# EAGLE design quadcopter_cape_v2 (EAGLE 6.5.0)
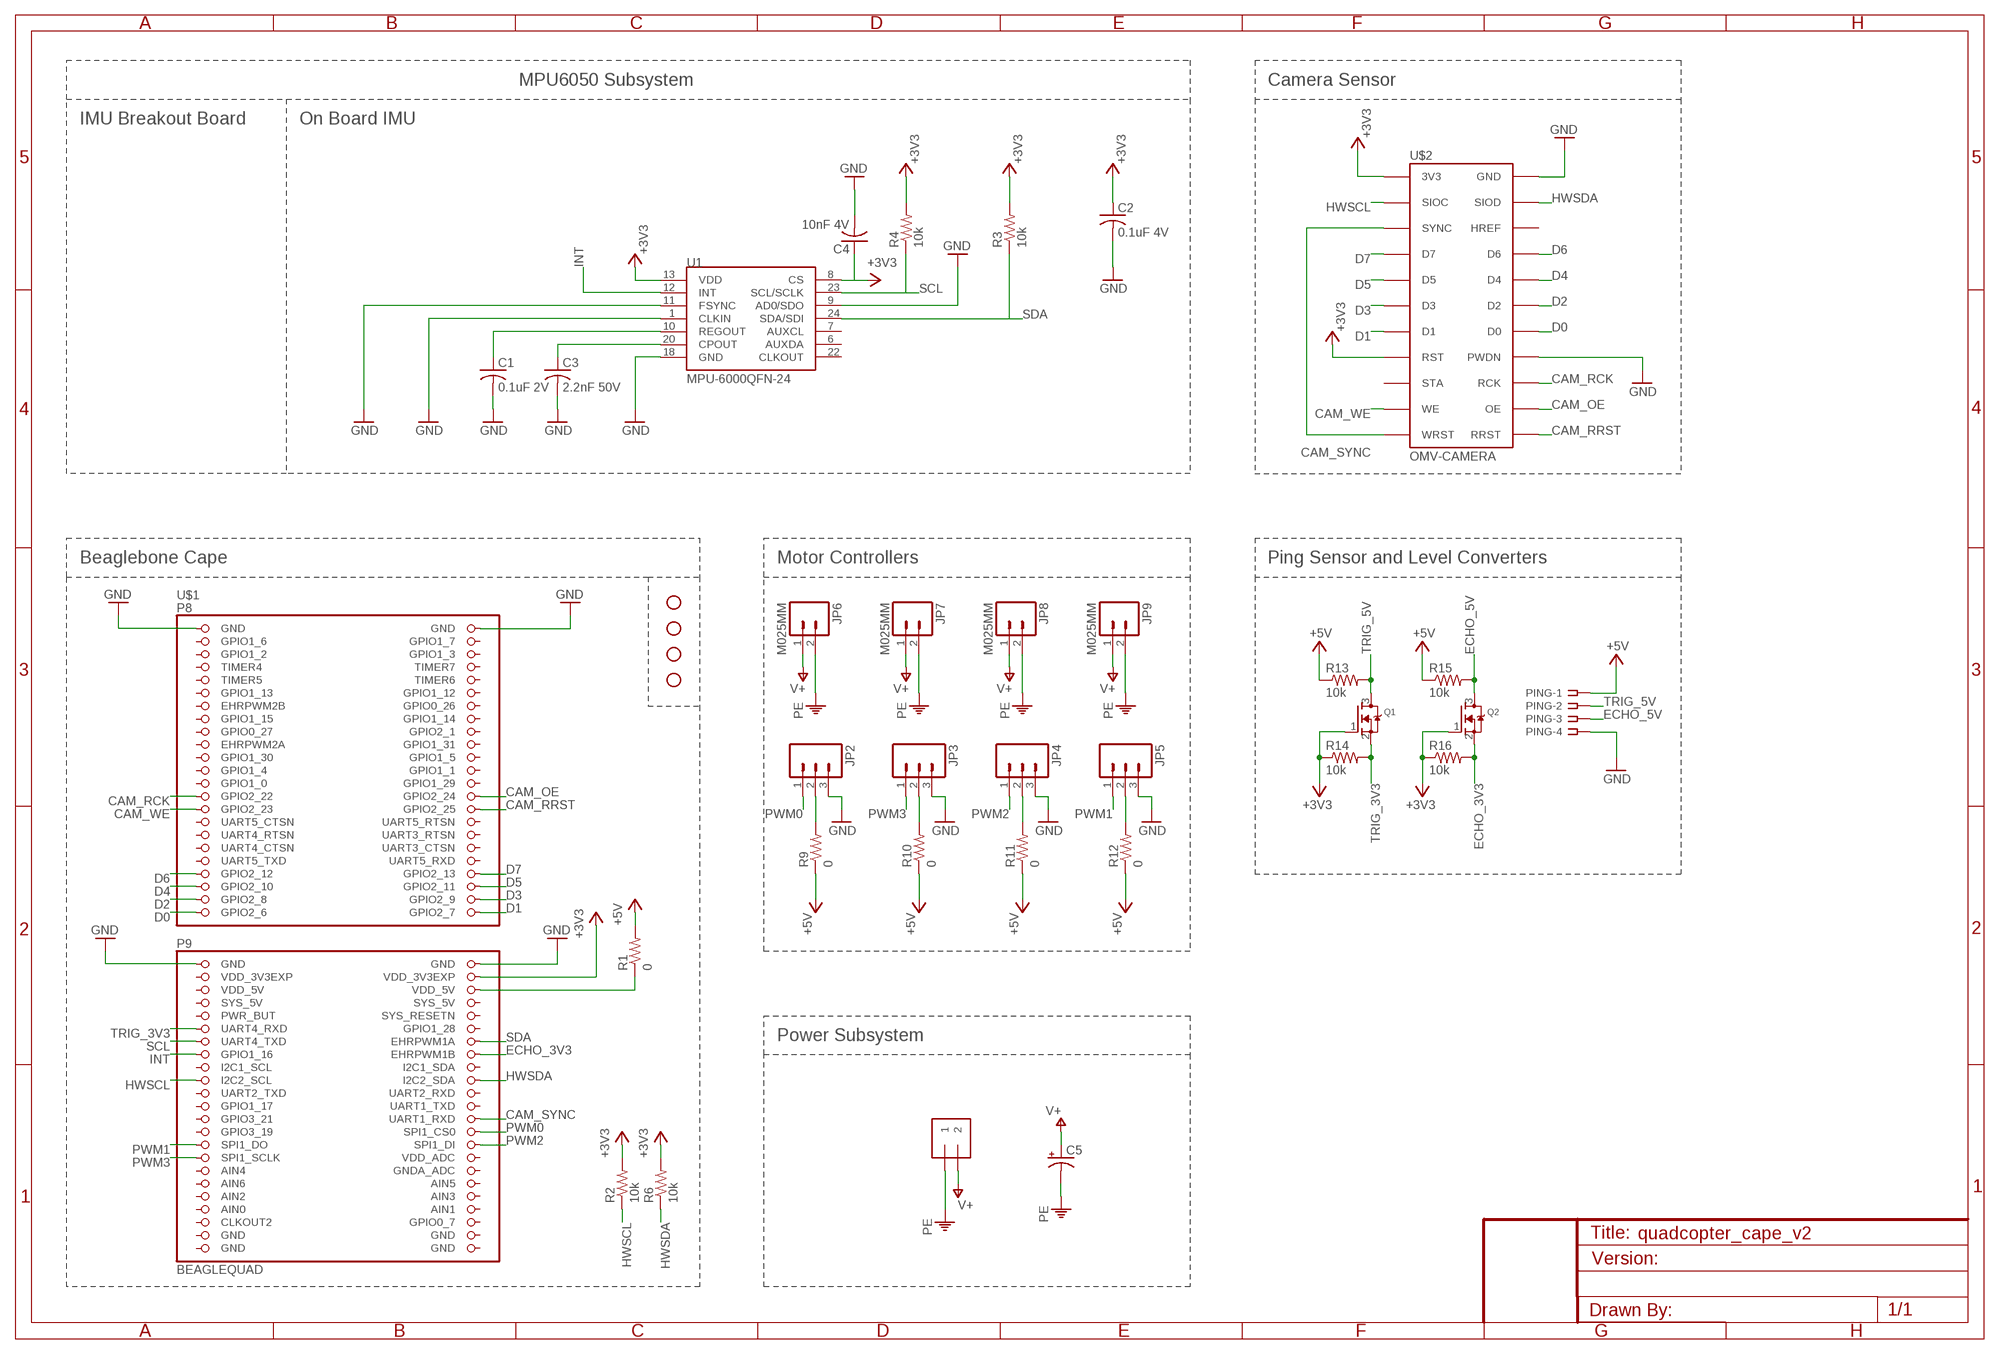
[diagram p0: schematic, sheet 1]

## Parts
C1  0.1uF 2V  C-USC0805  [C0805]
C2  0.1uF 4V  C-USC0805  [C0805]
C3  2.2nF 50V  C-USC0805  [C0805]
C4  10nF 4V  C-USC0805  [C0805]
C5  10UF-25V-20%(PTH)  [CPOL-RADIAL-10UF-25V]
JP2  M03PTH  [1X03]
JP3  M03PTH  [1X03]
JP4  M03PTH  [1X03]
JP5  M03PTH  [1X03]
JP6  M025MM  [SCREWTERMINAL-5MM-2]
JP7  M025MM  [SCREWTERMINAL-5MM-2]
JP8  M025MM  [SCREWTERMINAL-5MM-2]
JP9  M025MM  [SCREWTERMINAL-5MM-2]
PING  SSW-104-02-S-S-RA  [SSW-104-02-S-S-RA]
Q1  MOSFET-NREFLOW  [SOT23]
Q2  MOSFET-NREFLOW  [SOT23]
R1  0  R-US_M0805  [M0805]
R2  10k  R-US_M0805  [M0805]
R3  10k  R-US_M0805  [M0805]
R4  10k  R-US_M0805  [M0805]
R6  10k  R-US_M0805  [M0805]
R9  0  R-US_M0805  [M0805]
R10  0  R-US_M0805  [M0805]
R11  0  R-US_M0805  [M0805]
R12  0  R-US_M0805  [M0805]
R13  10k  R-US_M0805  [M0805]
R14  10k  R-US_M0805  [M0805]
R15  10k  R-US_M0805  [M0805]
R16  10k  R-US_M0805  [M0805]
STANDOFF1  STAND-OFF  [STAND-OFF]
STANDOFF2  STAND-OFF  [STAND-OFF]
STANDOFF3  STAND-OFF  [STAND-OFF]
STANDOFF4  STAND-OFF  [STAND-OFF]
U1  MPU-6000QFN-24  [QFN-24-TESTING]
U$1  BEAGLEQUAD  [BEAGLEQUAD_SHIELD]
U$2  OMV-CAMERA  [OMV-CAMERA]
U$3  1X2-12AWG  [1X2-12AWG]

## Nets
+3V3: C2.1 C4.1 Q1.1(G) Q2.1(G) R2.2 R3.2 R4.2 R6.2 R14.1 R16.1 U1.8(CS) U1.13(VDD) U$1.50(VDD_3V3EXP) U$2.3V3 U$2.RST
+5V: PING.1 R1.2 R9.1 R10.1 R11.1 R12.1 R13.1 R15.1
CAM_OE: U$1.28(GPIO2_24) U$2.OE
CAM_RCK: U$1.27(GPIO2_22) U$2.RCK
CAM_RRST: U$1.30(GPIO2_25) U$2.RRST
CAM_SYNC: U$1.72(UART1_RXD) U$2.SYNC U$2.WRST
CAM_WE: U$1.29(GPIO2_23) U$2.WE
D0: U$1.45(GPIO2_6) U$2.D0
D1: U$1.46(GPIO2_7) U$2.D1
D2: U$1.43(GPIO2_8) U$2.D2
D3: U$1.44(GPIO2_9) U$2.D3
D4: U$1.41(GPIO2_10) U$2.D4
D5: U$1.42(GPIO2_11) U$2.D5
D6: U$1.39(GPIO2_12) U$2.D6
D7: U$1.40(GPIO2_13) U$2.D7
ECHO_3V3: Q2.2(S) R16.2 U$1.62(EHRPWM1B)
ECHO_5V: PING.3 Q2.3(D) R15.2
GND: C1.2 C2.2 C3.2 C4.2 JP2.3 JP3.3 JP4.3 JP5.3 PING.4 U1.1(CLKIN) U1.9(AD0/SDO) U1.11(FSYNC) U1.18(GND) U$1.1(GND) U$1.2(GND) U$1.47(GND) U$1.48(GND) U$2.GND U$2.PWDN
HWSCL: R2.1 U$1.65(I2C2_SCL) U$2.SIOC
HWSDA: R6.1 U$1.66(I2C2_SDA) U$2.SIOD
INT: U1.12(INT) U$1.61(GPIO1_16)
N$1: R1.1 U$1.52(VDD_5V)
N$3: C1.1 U1.10(REGOUT)
N$4: C3.1 U1.20(CPOUT)
N$10: JP2.2 R9.2
N$11: JP3.2 R10.2
N$12: JP4.2 R11.2
N$13: JP5.2 R12.2
PE: C5.2(-) JP6.2 JP7.2 JP8.2 JP9.2 U$3.P$1
PWM0: JP2.1 U$1.74(SPI1_CS0)
PWM1: JP5.1 U$1.75(SPI1_DO)
PWM2: JP4.1 U$1.76(SPI1_DI)
PWM3: JP3.1 U$1.77(SPI1_SCLK)
SCL: R4.1 U1.23(SCL/SCLK) U$1.59(UART4_TXD)
SDA: R3.1 U1.24(SDA/SDI) U$1.60(EHRPWM1A)
TRIG_3V3: Q1.2(S) R14.2 U$1.57(UART4_RXD)
TRIG_5V: PING.2 Q1.3(D) R13.2
V+: C5.1(+) JP6.1 JP7.1 JP8.1 JP9.1 U$3.P$2
Unconnected: U1.6(AUXDA) U1.7(AUXCL) U1.22(CLKOUT) U$1.3(GPIO1_6) U$1.4(GPIO1_7) U$1.5(GPIO1_2) U$1.6(GPIO1_3) U$1.7(TIMER4) U$1.8(TIMER7) U$1.9(TIMER5) U$1.10(TIMER6) U$1.11(GPIO1_13) U$1.12(GPIO1_12) U$1.13(EHRPWM2B) U$1.14(GPIO0_26) U$1.15(GPIO1_15) U$1.16(GPIO1_14) U$1.17(GPIO0_27) U$1.18(GPIO2_1) U$1.19(EHRPWM2A) U$1.20(GPIO1_31) U$1.21(GPIO1_30) U$1.22(GPIO1_5) U$1.23(GPIO1_4) U$1.24(GPIO1_1) U$1.25(GPIO1_0) U$1.26(GPIO1_29) U$1.31(UART5_CTSN) U$1.32(UART5_RTSN) U$1.33(UART4_RTSN) U$1.34(UART3_RTSN) U$1.35(UART4_CTSN) U$1.36(UART3_CTSN) U$1.37(UART5_TXD) U$1.38(UART5_RXD) U$1.54(SYS_5V) U$1.55(PWR_BUT) U$1.56(SYS_RESETN) U$1.58(GPIO1_28) U$1.63(I2C1_SCL) U$1.64(I2C1_SDA) U$1.67(UART2_TXD) U$1.68(UART2_RXD) U$1.69(GPIO1_17) U$1.70(UART1_TXD) U$1.71(GPIO3_21) U$1.73(GPIO3_19) U$1.78(VDD_ADC) U$1.79(AIN4) U$1.80(GNDA_ADC) U$1.81(AIN6) U$1.82(AIN5) U$1.83(AIN2) U$1.84(AIN3) U$1.86(AIN1) U$1.87(CLKOUT2) U$1.88(GPIO0_7) U$2.HREF U$2.STA

## Notes on the sheet
- MPU6050 Subsystem | Camera Sensor
- IMU Breakout Board | On Board IMU
- Beaglebone Cape | Motor Controllers | Ping Sensor and Level Converters
- Power Subsystem

## Power pins joined to a net without a drawn wire
AIN0: U$1.85(AIN0)
GND: U$1.89(GND) U$1.90(GND) U$1.91(GND) U$1.92(GND)
SYS_5V: U$1.53(SYS_5V)
VDD_3V3EXP: U$1.49(VDD_3V3EXP)
VDD_5V: U$1.51(VDD_5V)

## Library data of the parts
C1-C4 = resistor:C-US: CAPACITOR, American symbol
C5 = SparkFun-Capacitors:10UF-25V-20%(PTH): CAP-08440; PROD_ID: CAP-08440
JP2-JP5 = SparkFun-Connectors:M03: Header 3 Standard 3-pin 0.1" header. Use with straight break away headers (SKU : PRT-00116), right angle break away headers (PRT-00553), swiss pins (PRT-00743), machine pins (PRT-00117), and female headers (PRT-00115). Molex polarized connector foot print use with SKU : PRT-08232 with associated crimp pins and housings.
JP6-JP9 = SparkFun-Connectors:M02: Standard 2-pin 0.1" header. Use with - straight break away headers ( PRT-00116) - right angle break away headers (PRT-00553) - swiss pins (PRT-00743) - machine pins (PRT-00117) - female headers (PRT-00115) Molex polarized connector foot print use with: PRT-08233 with associated crimp pins and housings. 2.54_SCREWTERM for use with PRT-10571. 3.5mm Screw Terminal footprints for PRT-08084 5mm Screw Terminal footprints for use with PRT-08433
PING = con-samtec:SSW-104-02-S-S: THROUGH-HOLE .025" SQ POST SOCKET Source: Samtec SSW.pdf; MPN: SSW-104-02-S-S-RA; OC_FARNELL: unknown; OC_NEWARK: 11P9385
Q1 Q2 = adafruit:MOSFET-N: N-Channel Mosfet 2N7002E - 60V 260mA SOT23 [Digikey: 2N7002ET1GOSTR-ND] - REEL BSH103 - 30V 850mA SOT23 [Digikey: 568-5013-1-ND]
R1-R4 R6 R9-R16 = resistor:R-US_: RESISTOR, American symbol
STANDOFF1-STANDOFF4 = SparkFun-Electromechanical:STAND-OFF: #4 Stand Off This is the mechanical footprint for a #4 phillips button head screw. Use the keepout ring to avoid running the screw head into surrounding components. SKU : PRT-00447
U1 = SparkFun-Sensors:MPU-6000: MPU-6000 - I2C address is 0x68 with AD0 low and 0x69 with AD0 high.
U$1 = adafruit:BEAGLEQUAD: Beaglebone Black Quadcopter Cape V2.0
U$2 = adafruit:OMV-CAMERA
U$3 = adafruit:1X2-12AWG

## Board
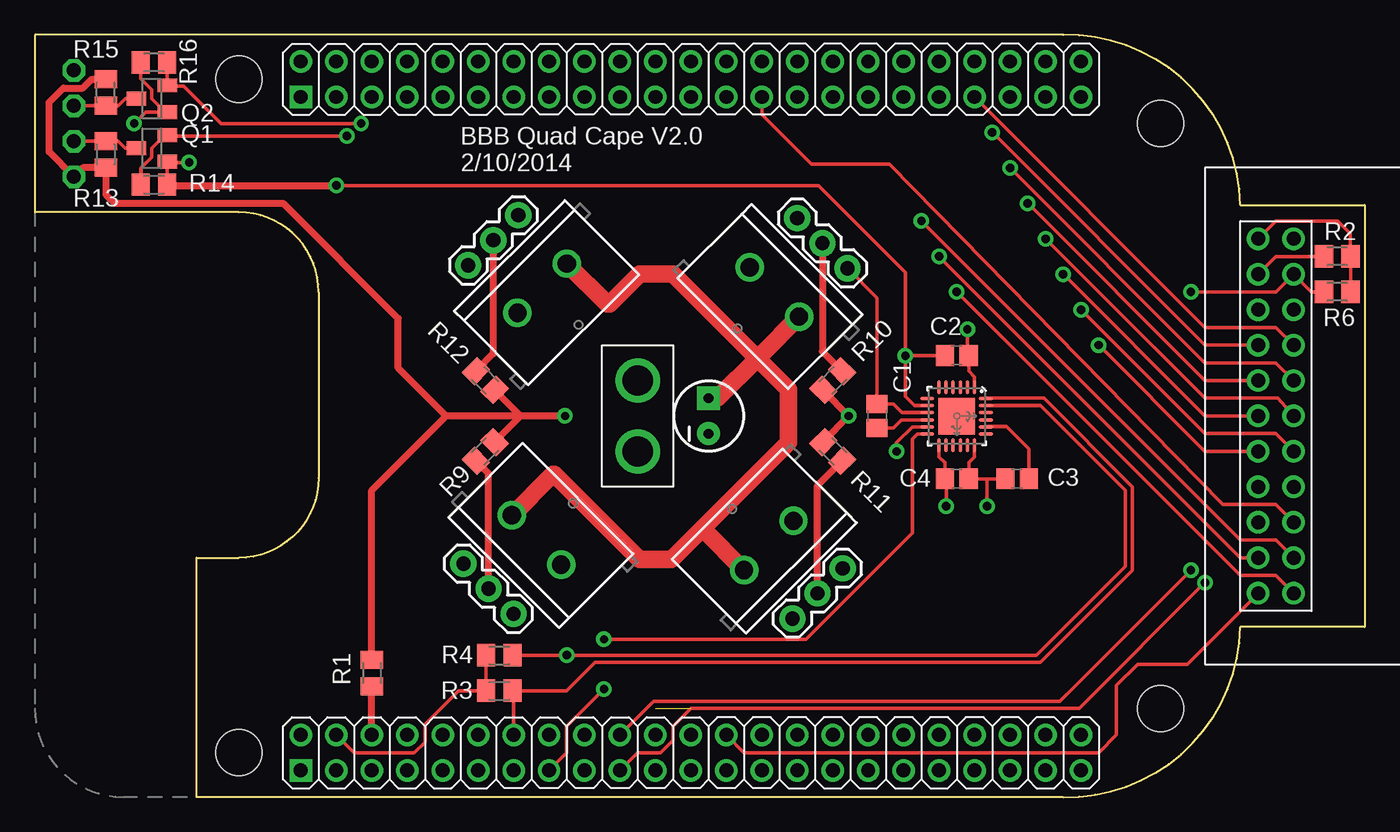
[diagram p1: board, top side]
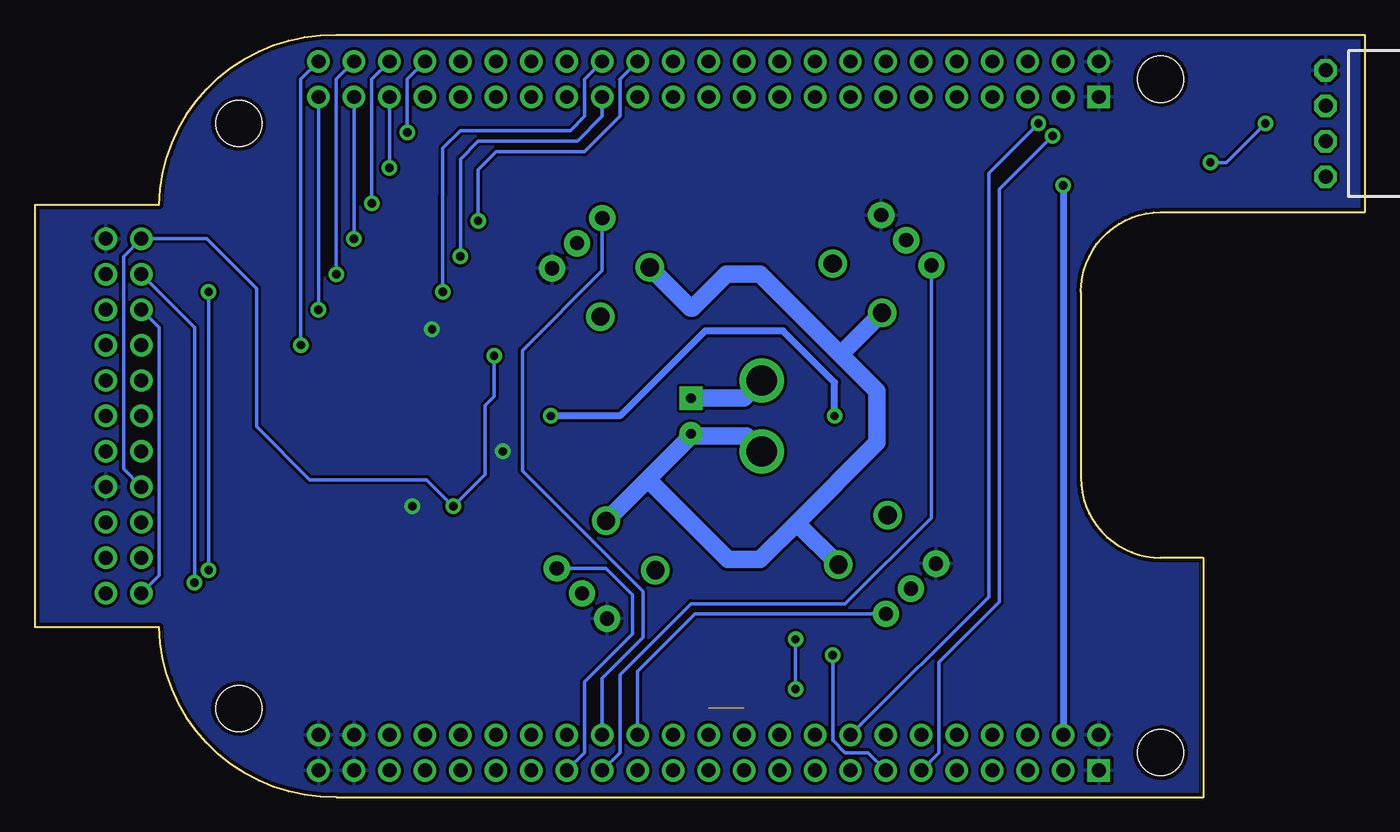
[diagram p2: board, bottom side, seen from below]

Size 95.25 x 54.61 mm. Coordinates in mm from the lower left corner, seen from the top.
Copper layers (1*16): Top 0.035mm / dielectric 1.5mm / Bottom 0.035mm
Design rules "SparkFun *": minimum track width 8mil, minimum drill 20mil, track to track 8mil, track to pad 8mil, pad to pad 8mil, via to via 8mil, smd to smd 8mil, copper to edge 10mil, drill to drill 8mil, minimum pad ring 12mil, minimum via ring 10mil, stop-mask expansion 4mil, vias tented up to drill 25mil, thermal gap 10mil

### Footprints (pad centres in the part's own frame; a part is rotated, then mirrored left to right if it is on the bottom)
C0805 = smd 1.3 x 1.5: 1 -0.85,0; 2 0.85,0
CPOL-RADIAL-10UF-25V = drill 0.7 pad 1.651 square: 1 1.27,0 | drill 0.7 pad 1.651: 2 -1.27,0
1X03 = drill 1.016 pad 1.88: 1 0,0; 2 2.54,0; 3 5.08,0
SCREWTERMINAL-5MM-2 = drill 1.3 pad 2.032: 1 0,0; 2 5,0
SSW-104-02-S-S-RA = drill 1 pad 1.5 octagon: 1 -3.81,1.524; 2 -1.27,1.524; 3 1.27,1.524; 4 3.81,1.524
SOT23 = smd 1 x 1.4: 1 -0.95,-1.1; 2 0.95,-1.1; 3 0,1.1
M0805 = smd 1.3 x 1.6: 1 -0.95,0; 2 0.95,0
STAND-OFF = hole 3.302: 0,0
QFN-24-TESTING = smd 1.016 x 0.254: 1 -2.066,1.257; 2 -2.066,0.75; 3 -2.066,0.247; 4 -2.066,-0.287; 5 -2.066,-0.792; 6 -2.066,-1.297; 13 2.086,-1.297; 14 2.086,-0.792; 15 2.086,-0.287; 16 2.086,0.247; 17 2.086,0.75; 18 2.086,1.257 | smd 0.254 x 1.016: 7 -1.267,-2.122; 8 -0.762,-2.122; 9 -0.258,-2.122; 10 0.278,-2.122; 11 0.78,-2.122; 12 1.287,-2.122; 19 1.287,2.082; 20 0.78,2.082; 21 0.278,2.082; 22 -0.258,2.082; 23 -0.762,2.082; 24 -1.267,2.082 | smd 2.616 x 2.616: P$1 0.02,-0.01
BEAGLEQUAD_SHIELD = drill 1 square: 1 4.445,19.05; 47 52.705,19.05 | drill 1: 2 1.905,19.05; 3 4.445,21.59; 4 1.905,21.59; 5 4.445,24.13; 6 1.905,24.13; 7 4.445,26.67; 8 1.905,26.67; 9 4.445,29.21; 10 1.905,29.21; 11 4.445,31.75; 12 1.905,31.75; 13 4.445,34.29; 14 1.905,34.29; 15 4.445,36.83; 16 1.905,36.83; 17 4.445,39.37; 18 1.905,39.37; 19 4.445,41.91; 20 1.905,41.91; 21 4.445,44.45; 22 1.905,44.45; 23 4.445,46.99; 24 1.905,46.99; 25 4.445,49.53; 26 1.905,49.53; 27 4.445,52.07; 28 1.905,52.07; 29 4.445,54.61; 30 1.905,54.61; 31 4.445,57.15; 32 1.905,57.15; 33 4.445,59.69; 34 1.905,59.69; 35 4.445,62.23; 36 1.905,62.23; 37 4.445,64.77; 38 1.905,64.77; 39 4.445,67.31; 40 1.905,67.31; 41 4.445,69.85; 42 1.905,69.85; 43 4.445,72.39; 44 1.905,72.39; 45 4.445,74.93; 46 1.905,74.93; 48 50.165,19.05; 49 52.705,21.59; 50 50.165,21.59; 51 52.705,24.13; 52 50.165,24.13; 53 52.705,26.67; 54 50.165,26.67; 55 52.705,29.21; 56 50.165,29.21; 57 52.705,31.75; 58 50.165,31.75; 59 52.705,34.29; 60 50.165,34.29; 61 52.705,36.83; 62 50.165,36.83; 63 52.705,39.37; 64 50.165,39.37; 65 52.705,41.91; 66 50.165,41.91; 67 52.705,44.45; 68 50.165,44.45; 69 52.705,46.99; 70 50.165,46.99; 71 52.705,49.53; 72 50.165,49.53; 73 52.705,52.07; 74 50.165,52.07; 75 52.705,54.61; 76 50.165,54.61; 77 52.705,57.15; 78 50.165,57.15; 79 52.705,59.69; 80 50.165,59.69; 81 52.705,62.23; 82 50.165,62.23; 83 52.705,64.77; 84 50.165,64.77; 85 52.705,67.31; 86 50.165,67.31; 87 52.705,69.85; 88 50.165,69.85; 89 52.705,72.39; 90 50.165,72.39; 91 52.705,74.93; 92 50.165,74.93
OMV-CAMERA = drill 1: 3V3 -1.27,12.7; D0 1.27,-2.54; D1 -1.27,-2.54; D2 1.27,0; D3 -1.27,0; D4 1.27,2.54; D5 -1.27,2.54; D6 1.27,5.08; D7 -1.27,5.08; GND 1.27,12.7; HREF 1.27,7.62; OE 1.27,-10.16; PWDN 1.27,-5.08; RCK 1.27,-7.62; RRST 1.27,-12.7; RST -1.27,-5.08; SIOC -1.27,10.16; SIOD 1.27,10.16; STA -1.27,-7.62; SYNC -1.27,7.62; WE -1.27,-10.16; WRST -1.27,-12.7
1X2-12AWG = drill 2.159: P$1 0,0; P$2 0,5.08

### Placement (x,y rotation side)
C1  60.33,27.3 90 top
C2  66.04,31.65 0 top
C3  70.36,22.81 180 top
C4  66.04,22.81 0 top
C5  48.26,27.3 90 top
JP2  34.29,13.13 135 top
JP3  57.86,16.38 225 top
JP4  54.61,41.48 315 top
JP5  31.04,38.1 45 top
JP6  34.16,20.19 315 top
JP7  50.8,16.26 45 top
JP8  54.74,34.42 135 top
JP9  38.1,38.23 225 top
PING  1.27,48.26 90 bottom
Q1  8.38,46.48 90 top
Q2  8.38,50.04 90 top
R1  24.13,8.89 90 top
R2  93.29,38.73 0 top
R3  33.27,7.62 180 top
R4  33.27,10.16 180 top
R6  93.29,36.2 0 top
R9  32.26,24.77 225 top
R10  57.15,24.77 315 top
R11  57.15,29.84 45 top
R12  32.26,29.84 135 top
R13  5.08,46.04 90 top
R14  8.53,43.88 180 top
R15  5.08,50.48 270 top
R16  8.53,52.64 0 top
STANDOFF1  14.61,3.17 0 top
STANDOFF2  80.64,6.35 0 top
STANDOFF3  80.64,48.26 0 top
STANDOFF4  14.61,51.44 0 top
U1  66.04,27.3 270 top
U$1  0,54.61 270 top
U$2  88.9,27.3 0 top
U$3  43.18,24.77 0 top

### Tracks (layer width: path | path; a pad name or v marks a point on that pad's centre or on a via)
+3V3  (via drill 0.6)
  Top 0.254: R6.2 R2.2 94.23,38.74 94.23,40.39 93.34,41.27 88.9,41.27 U$2.3V3 | R14.1 9.48,43.82 Q1.1 9.48,45.47 v11.05,45.47 | R16.1 7.58,51.48 8.38,50.67 8.38,50.04 9.33,49.09 Q2.1 7.94,49.09 v7.11,48.26 | R4.2 R3.2 30.35,7.62 27.94,5.21 27.94,3.94 27.18,3.17 22.86,3.17 U$1.50 | U1.8 | U1.8 62.99,28.07 | 62.99,28.07 | U1.13 64.77,25.19 64.77,24.38 65.19,23.96 C4.1 65.28,22.72 v65.28,20.83 | v21.59,43.81 56.13,43.81 62.36,37.59 v62.36,31.62 | C2.1 62.38,31.65 arc90 v62.36,31.62 | U1.8 62.99,28.07 | 62.99,28.07 62.36,28.7 v62.36,31.62
  Top 0.508: 9.48,43.82 v21.59,43.82 v21.59,43.81
  Bottom 0.254: U$2.RST 88.9,23.5 88.9,38.73 U$2.3V3 82.93,40.01 79.38,36.45 79.38,26.54 75.56,22.73 67.18,22.73 v65.28,20.83 62.99,23.11 62.99,28.07 62.36,28.7 v62.36,31.62 | v7.11,48.26 9.91,45.47 v11.05,45.47
  Bottom 0.508: v21.59,43.81 U$1.50
+5V  (via drill 0.6)
  Top 0.254: 56.48,25.49 R10.1 | R11.1 56.48,29.12 | R9.1
  Top 0.508: 56.48,25.49 v58.29,27.3 56.48,29.12 | v37.97,27.3 34.8,27.3 | 34.8,27.3 | 34.8,27.3 R12.1 | R9.1 34.8,27.3 | R15.1 4.06,51.43 3.43,50.8 2.03,50.8 1.02,49.78 1.02,46.23 PING.1 3.43,45.09 R13.1 5.08,43.18 5.71,42.55 17.78,42.55 26.04,34.29 26.04,30.73 29.46,27.3 | R12.1 | R12.1 34.8,27.3 | 34.8,27.3 29.46,27.3 | 29.46,27.3 24.13,21.97 R1.2
  Bottom 0.508: v37.97,27.3 37.97,29.72 41.66,33.4 47.24,33.4 53.34,27.3 v58.29,27.3
CAM_OE  (via drill 0.6)
  Top 0.254: U$2.OE 88.9,18.41 86.36,18.41 v63.5,41.27
  Bottom 0.254: U$1.28 53.34,51.44 53.34,48.77 55.88,46.23 62.23,46.23 63.5,44.96 v63.5,41.27
CAM_RCK
  Top 0.254: U$2.RCK 88.9,20.95 85.09,20.95 61.21,45.34 55.63,45.34 52.07,48.9 U$1.27
CAM_RRST  (via drill 0.6)
  Top 0.254: U$2.RRST 88.9,15.88 86.36,15.88 v66.04,36.2
  Bottom 0.254: U$1.30 55.88,51.44 55.88,48.77 56.9,47.75 64.77,47.75 66.04,46.48 66.04,43.31 66.04,43.18 v66.04,36.2
CAM_SYNC
  Top 0.254: U$1.72 50.8,3.17 76.2,3.17 77.47,4.45 77.47,8 78.99,9.53 82.55,9.53 U$2.WRST
  Bottom 0.254: U$2.WRST 86.36,15.88 86.36,33.66 U$2.SYNC
CAM_WE  (via drill 0.6)
  Top 0.254: U$2.WE 86.36,17.14 v64.77,38.73
  Bottom 0.254: U$1.29 54.61,48.77 56.39,46.99 63.5,46.99 64.77,45.72 v64.77,38.73
D0  (via drill 0.6)
  Top 0.254: U$2.D0 88.9,26.04 83.82,26.04 v74.93,34.92
  Bottom 0.254: U$1.45 v74.93,34.92
D1  (via drill 0.6)
  Top 0.254: U$2.D1 83.82,24.77 v76.2,32.38
  Bottom 0.254: U$1.46 76.2,51.44 v76.2,32.38
D2  (via drill 0.6)
  Top 0.254: U$2.D2 89.03,28.57 83.82,28.57 v72.39,40.01
  Bottom 0.254: U$1.43 v72.39,40.01
D3  (via drill 0.6)
  Top 0.254: U$2.D3 83.82,27.3 v73.66,37.47
  Bottom 0.254: U$1.44 73.66,51.44 v73.66,37.47
D4  (via drill 0.6)
  Top 0.254: U$2.D4 88.9,31.11 83.82,31.11 v69.85,45.09
  Bottom 0.254: v69.85,45.09 U$1.41
D5  (via drill 0.6)
  Top 0.254: U$2.D5 83.82,29.84 v71.12,42.55
  Bottom 0.254: U$1.42 71.12,51.44 v71.12,42.55
D6
  Top 0.254: U$2.D6 88.9,33.66 83.82,33.66 U$1.39
D7  (via drill 0.6)
  Top 0.254: U$2.D7 83.82,32.38 v68.58,47.62
  Bottom 0.254: U$1.40 68.58,51.44 v68.58,47.62
ECHO_3V3  (via drill 0.6)
  Top 0.254: R16.2 9.48,52.7 Q2.2 9.55,50.93 10.67,50.93 13.34,48.26 v23.37,48.26
  Bottom 0.254: v23.37,48.26 26.92,44.7 26.92,14.35 U$1.62
ECHO_5V
  Top 0.254: PING.3 R15.2 | R15.2 | Q2.3 6.48,50.04 5.97,49.53 R15.2 | R15.2
GND  (via drill 0.6)
  Top 0.254: U1.9 62.1,27.56 61.51,28.16 C1.2 60.33,35.76 JP4.3 | U1.11 62.85,26.52 61.72,25.4 v61.72,24.77 | U1.1 67.31,29.38 67.31,30.1 66.89,30.52 C2.2 66.8,31.74 v66.8,33.53 | U1.18 67.31,25.21 67.31,24.38 66.89,23.96 C4.2 68.2,22.81 | 68.2,22.81 C3.2 | v68.2,20.83 68.2,22.81
  pour Bottom: 0,54.61 95.25,54.61 95.25,0 0,0
HWSCL  (via drill 0.6)  (1 unrouted)
  Top 0.254: R2.1 88.9,38.73 U$2.SIOC | U$1.65 43.18,3.17 44.83,3.17 45.72,4.06 45.72,5.08 46.99,6.35 74.8,6.35 v83.82,15.37
  Bottom 0.254: U$2.SIOC 83.82,33.66 v83.82,15.37
HWSDA  (via drill 0.6)
  Top 0.254: v82.8,36.2 88.9,36.2 U$2.SIOD 91.44,36.2 R6.1 | U$1.66 44.32,6.86 73.41,6.86 v82.8,16.26
  Bottom 0.254: v82.8,36.2 v82.8,16.26
INT  (via drill 0.6)
  Top 0.254: U1.12 63.23,26.02 62.87,25.65 62.87,18.92 55.24,11.3 v40.77,11.3 | U$1.61 38.1,3.17 38.1,5.08 v40.77,7.75
  Bottom 0.254: v40.77,7.75 v40.77,11.3
N$1
  Top 0.508: U$1.52 R1.1
N$3
  Top 0.254: U1.10 62.08,27.03 61.51,26.45 C1.1
N$4
  Top 0.254: U1.20 68.14,26.54 69.6,26.54 71.21,24.93 C3.1
N$10
  Top 0.508: JP2.2 32.49,23.19 R9.2
N$11
  Top 0.508: JP3.2 56.06,22.34 R10.2
N$12
  Top 0.508: JP4.2 56.41,31.93 R11.2
N$13
  Top 0.508: JP5.2 32.84,31.77 R12.2
PE
  Bottom 1.27: JP9.2 37.47,31.79 37.47,31.75 37.59,31.75 | 37.59,31.75 43.31,37.47 45.72,37.47 48.13,35.05 48.3,35.05 JP8.2 | 40.7,19.62 43.31,17.02 45.59,17.02 51.31,22.73 51.39,22.73 | 40.7,19.62 34.92,25.4 34.92,29.08 37.59,31.75 | 37.59,31.75 37.59,31.88 | JP6.2 40.66,19.62 40.7,19.62 | JP7.2 51.39,22.73 | C5.2 48.26,25.87 | 48.26,25.87 51.39,22.73 | 48.26,25.87 44.28,25.87 U$3.P$1
PWM0
  Bottom 0.254: JP2.1 47.95,13.13 52.07,9.02 U$1.74
PWM1
  Bottom 0.254: U$1.75 53.34,3.17 53.34,8.76 48.26,13.84 37.21,13.84 31.04,20.02 JP5.1
PWM2
  Bottom 0.254: U$1.76 54.61,8.51 51.69,11.43 51.69,14.73 60.33,23.37 60.33,32 54.61,37.72 JP4.1
PWM3
  Bottom 0.254: U$1.77 55.88,3.17 55.88,8.26 52.45,11.68 52.45,14.48 54.36,16.38 JP3.1
SCL  (via drill 0.6)
  Top 0.254: R4.1 v38.1,10.16 71.75,10.16 78.11,16.51 78.11,21.97 72.01,28.07 U1.23
  Bottom 0.254: U$1.59 35.56,3.17 37.21,3.17 38.1,4.06 v38.1,10.16
SDA
  Top 0.254: U$1.60 34.29,7.17 R3.1 34.48,7.37 34.73,7.62 38.1,7.62 40.13,9.65 72.01,9.65 78.61,16.26 78.61,22.23 72.26,28.57 U1.24
TRIG_3V3  (via drill 0.6)
  Top 0.254: 7.62,45.09 7.58,45.04 R14.2 7.62,43.86 7.62,45.09 | 9.27,47.37 9.33,47.43 Q1.2 | 7.62,45.09 8.38,45.85 8.38,46.48 9.27,47.37 | 9.27,47.37 v22.35,47.37
  Bottom 0.254: U$1.57 30.48,3.17 30.48,9.65 26.16,13.97 26.16,43.56 v22.35,47.37
TRIG_5V
  Top 0.254: PING.2 R13.2 | R13.2 | Q1.3 6.48,46.48 5.97,46.99 R13.2 | R13.2
V+
  Top 1.27: 51.69,31.5 45.72,37.47 43.31,37.47 41.15,35.31 41.02,35.31 JP9.1 | 51.69,31.5 53.98,29.21 53.98,25.4 47.75,19.18 | 47.75,19.18 45.59,17.02 43.31,17.02 37.21,23.11 37.08,23.11 JP6.1 | JP8.1 52.01,31.69 51.82,31.5 | 51.82,31.5 51.69,31.5 | JP7.1 47.88,19.18 47.75,19.18 | C5.1 48.9,28.57 51.82,31.5
  Bottom 1.27: C5.1 44.45,28.57 U$3.P$2

### Text on the board
tNames: BBB Quad Cape V2.0 | 2/10/2014